# Altium schematic sheet 3_MCU.SchDoc
size A3
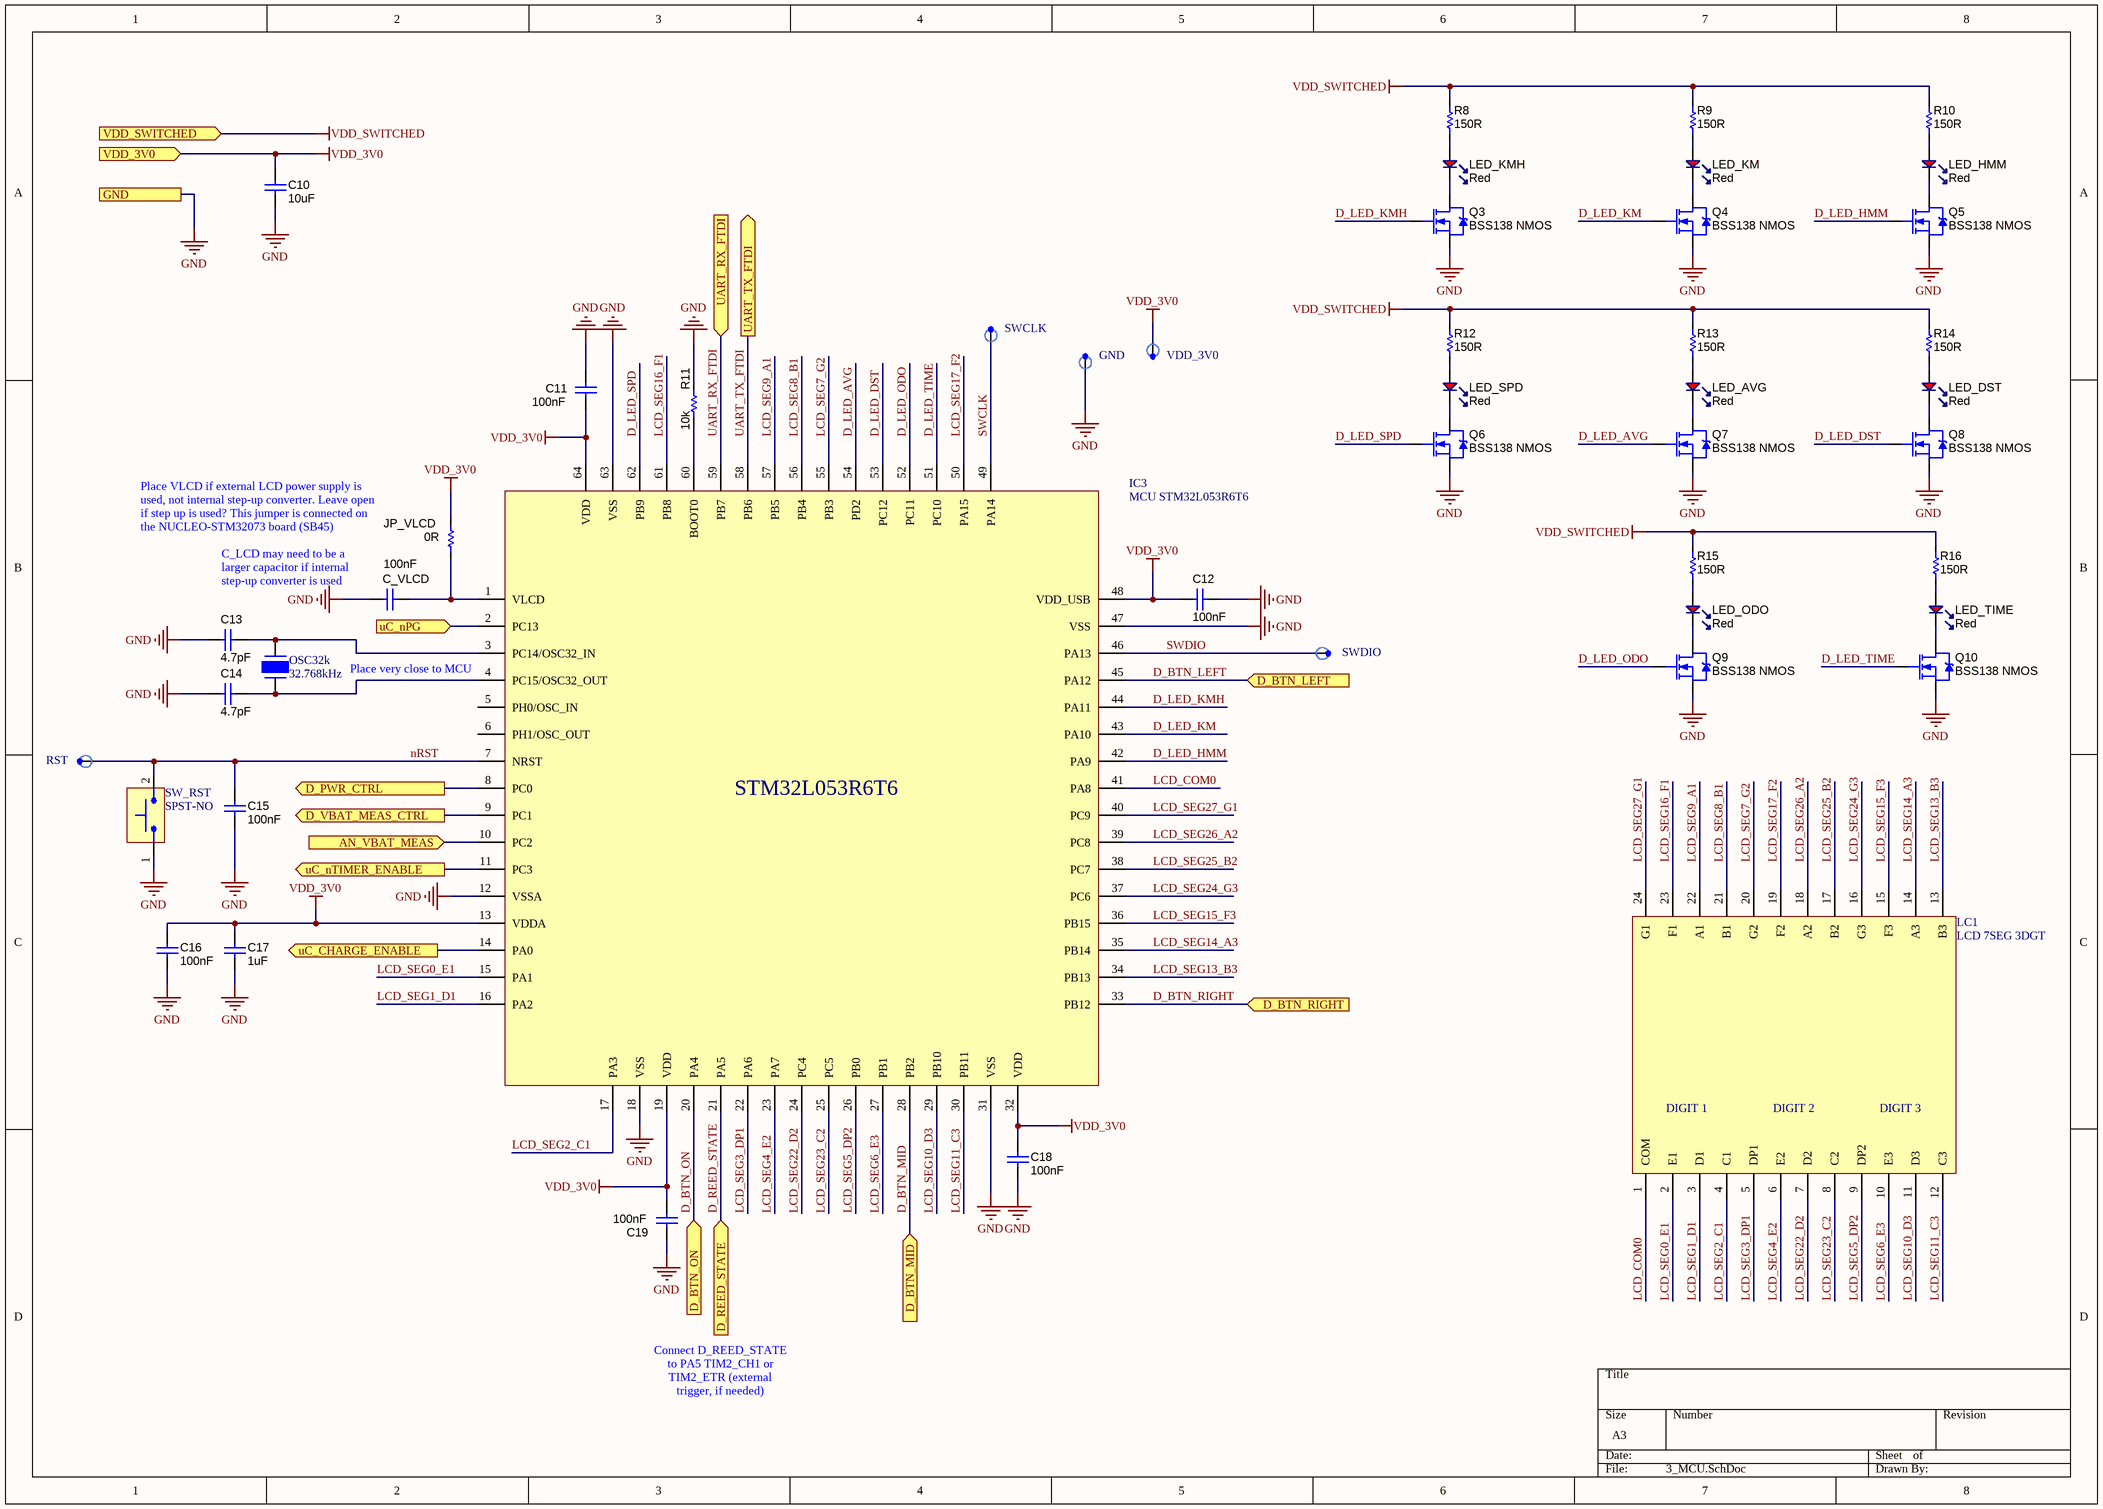
[diagram p0: 3_MCU.SchDoc]

## Parts
C10  10uF  [CAP_0603]
C11  100nF  [CAP_0603]
C12  100nF  [CAP_0603]
C13  4.7pF  [CAP_0603]
C14  4.7pF  [CAP_0603]
C15  100nF  [CAP_0603]
C16  100nF  [CAP_0603]
C17  1uF  [CAP_0603]
C18  100nF  [CAP_0603]
C19  100nF  [CAP_0603]
C_VLCD  100nF  [CAP_0603]
GND  Testpoint_SMD  [Testpoint_SMD]  (value not drawn)
IC3  MCU STM32L053R6T6  [LQFP-64]
JP_VLCD  0R  [RES_0603]
LC1  LCD 7SEG 3DGT  [24 pin 3 digit LCD (7.9mm character height)]
LED_AVG  Red  [LED_0603]
LED_DST  Red  [LED_0603]
LED_HMM  Red  [LED_0603]
LED_KM  Red  [LED_0603]
LED_KMH  Red  [LED_0603]
LED_ODO  Red  [LED_0603]
LED_SPD  Red  [LED_0603]
LED_TIME  Red  [LED_0603]
OSC32k  32.768kHz  [2x6mm cylindrical can - 0.7mm through hole]
Q3  BSS138 NMOS  [SOT-23-3]
Q4  BSS138 NMOS  [SOT-23-3]
Q5  BSS138 NMOS  [SOT-23-3]
Q6  BSS138 NMOS  [SOT-23-3]
Q7  BSS138 NMOS  [SOT-23-3]
Q8  BSS138 NMOS  [SOT-23-3]
Q9  BSS138 NMOS  [SOT-23-3]
Q10  BSS138 NMOS  [SOT-23-3]
R8  150R  [RES_0603]
R9  150R  [RES_0603]
R10  150R  [RES_0603]
R11  10k  [RES_0603]
R12  150R  [RES_0603]
R13  150R  [RES_0603]
R14  150R  [RES_0603]
R15  150R  [RES_0603]
R16  150R  [RES_0603]
RST  Testpoint_SMD  [Testpoint_SMD]  (value not drawn)
SW_RST  SPST-NO  [SWITCH_TACTILE_SMD_6X3.5mm_2pin]
SWCLK  Testpoint_SMD  [Testpoint_SMD]  (value not drawn)
SWDIO  Testpoint_SMD  [Testpoint_SMD]  (value not drawn)
VDD_3V0  Testpoint_SMD  [Testpoint_SMD]  (value not drawn)

## Ports
AN_VBAT_MEAS (in), D_BTN_LEFT (in), D_BTN_MID (in), D_BTN_ON (in), D_BTN_RIGHT (in), D_PWR_CTRL (out), D_REED_STATE (in), D_VBAT_MEAS_CTRL (out), GND, UART_RX_FTDI (in), UART_TX_FTDI (out), uC_CHARGE_ENABLE (out), uC_nPG (in), uC_nTIMER_ENABLE (out), VDD_3V0 (in), VDD_SWITCHED (in)

## Nets
GND: C10.2 C11.2 C12.2 C13.2 C14.2 C15.2 C16.2 C17.2 C18.2 C19.1 C_VLCD.2 GND.1 IC3.12(VSSA) IC3.18(VSS) IC3.31(VSS) IC3.47(VSS) IC3.63(VSS) Q3.2(S) Q4.2(S) Q5.2(S) Q6.2(S) Q7.2(S) Q8.2(S) Q9.2(S) Q10.2(S) R11.2 SW_RST.1 ; port GND
VDD_3V0: C10.1 C11.1 C12.1 C16.1 C17.1 C18.1 C19.2 IC3.13(VDDA) IC3.19(VDD) IC3.32(VDD) IC3.48(VDD_USB) IC3.64(VDD) JP_VLCD.2 VDD_3V0.1 ; port VDD_3V0
VDD_SWITCHED: R8.2 R9.2 R10.2 R12.2 R13.2 R14.2 R15.2 R16.2 ; port VDD_SWITCHED
AN_VBAT_MEAS: IC3.10(PC2) ; port AN_VBAT_MEAS
D_BTN_LEFT: IC3.45(PA12) ; port D_BTN_LEFT
D_BTN_MID: IC3.28(PB2) ; port D_BTN_MID
D_BTN_ON: IC3.20(PA4) ; port D_BTN_ON
D_BTN_RIGHT: IC3.33(PB12) ; port D_BTN_RIGHT
D_LED_AVG: IC3.54(PD2) Q7.1(G)
D_LED_DST: IC3.53(PC12) Q8.1(G)
D_LED_HMM: IC3.42(PA9) Q5.1(G)
D_LED_KM: IC3.43(PA10) Q4.1(G)
D_LED_KMH: IC3.44(PA11) Q3.1(G)
D_LED_ODO: IC3.52(PC11) Q9.1(G)
D_LED_SPD: IC3.62(PB9) Q6.1(G)
D_LED_TIME: IC3.51(PC10) Q10.1(G)
D_PWR_CTRL: IC3.8(PC0) ; port D_PWR_CTRL
D_REED_STATE: IC3.21(PA5) ; port D_REED_STATE
D_VBAT_MEAS_CTRL: IC3.9(PC1) ; port D_VBAT_MEAS_CTRL
LCD_COM0: IC3.41(PA8) LC1.1(COM)
LCD_SEG0_E1: IC3.15(PA1) LC1.2(E1)
LCD_SEG1_D1: IC3.16(PA2) LC1.3(D1)
LCD_SEG2_C1: IC3.17(PA3) LC1.4(C1)
LCD_SEG3_DP1: IC3.22(PA6) LC1.5(DP1)
LCD_SEG4_E2: IC3.23(PA7) LC1.6(E2)
LCD_SEG5_DP2: IC3.26(PB0) LC1.9(DP2)
LCD_SEG6_E3: IC3.27(PB1) LC1.10(E3)
LCD_SEG7_G2: IC3.55(PB3) LC1.20(G2)
LCD_SEG8_B1: IC3.56(PB4) LC1.21(B1)
LCD_SEG9_A1: IC3.57(PB5) LC1.22(A1)
LCD_SEG10_D3: IC3.29(PB10) LC1.11(D3)
LCD_SEG11_C3: IC3.30(PB11) LC1.12(C3)
LCD_SEG13_B3: IC3.34(PB13) LC1.13(B3)
LCD_SEG14_A3: IC3.35(PB14) LC1.14(A3)
LCD_SEG15_F3: IC3.36(PB15) LC1.15(F3)
LCD_SEG16_F1: IC3.61(PB8) LC1.23(F1)
LCD_SEG17_F2: IC3.50(PA15) LC1.19(F2)
LCD_SEG22_D2: IC3.24(PC4) LC1.7(D2)
LCD_SEG23_C2: IC3.25(PC5) LC1.8(C2)
LCD_SEG24_G3: IC3.37(PC6) LC1.16(G3)
LCD_SEG25_B2: IC3.38(PC7) LC1.17(B2)
LCD_SEG26_A2: IC3.39(PC8) LC1.18(A2)
LCD_SEG27_G1: IC3.40(PC9) LC1.24(G1)
nRST: C15.1 IC3.7(NRST) RST.1 SW_RST.2
SWCLK: IC3.49(PA14) SWCLK.1
SWDIO: IC3.46(PA13) SWDIO.1
UART_RX_FTDI: IC3.59(PB7) ; port UART_RX_FTDI
UART_TX_FTDI: IC3.58(PB6) ; port UART_TX_FTDI
uC_CHARGE_ENABLE: IC3.14(PA0) ; port uC_CHARGE_ENABLE
uC_nPG: IC3.2(PC13) ; port uC_nPG
uC_nTIMER_ENABLE: IC3.11(PC3) ; port uC_nTIMER_ENABLE
NetC13_1: C13.1 IC3.3(PC14/OSC32_IN) OSC32k.1
NetC14_1: C14.1 IC3.4(PC15/OSC32_OUT) OSC32k.2
NetC_VLCD_1: C_VLCD.1 IC3.1(VLCD) JP_VLCD.1
NetIC3_60: IC3.60(BOOT0) R11.1
NetLED_AVG_A: LED_AVG.A R13.1
NetLED_AVG_K: LED_AVG.K Q7.3(D)
NetLED_DST_A: LED_DST.A R14.1
NetLED_DST_K: LED_DST.K Q8.3(D)
NetLED_HMM_A: LED_HMM.A R10.1
NetLED_HMM_K: LED_HMM.K Q5.3(D)
NetLED_KM_A: LED_KM.A R9.1
NetLED_KM_K: LED_KM.K Q4.3(D)
NetLED_KMH_A: LED_KMH.A R8.1
NetLED_KMH_K: LED_KMH.K Q3.3(D)
NetLED_ODO_A: LED_ODO.A R15.1
NetLED_ODO_K: LED_ODO.K Q9.3(D)
NetLED_SPD_A: LED_SPD.A R12.1
NetLED_SPD_K: LED_SPD.K Q6.3(D)
NetLED_TIME_A: LED_TIME.A R16.1
NetLED_TIME_K: LED_TIME.K Q10.3(D)

Not connected (* = marked no-connect by the designer): IC3 5(PH0/OSC_IN) 6(PH1/OSC_OUT)

## Notes on the sheet
- Place VLCD if external LCD power supply is used, not internal step-up converter. Leave open if step up is used? This jumper is connected on the NUCLEO-STM32073 board (SB45)
- (near C_VLCD) C_LCD may need to be a larger capacitor if internal step-up converter is used
- (near IC3) Place very close to MCU
- Connect D_REED_STATE to PA5 TIM2_CH1 or TIM2_ETR (external trigger, if needed)
- (in symbol LCD_7SEG_3DIGIT_0.31in) DIGIT 1; DIGIT 2; DIGIT 3

## Library data of the parts
C10 = CAP_10uF_16V_0603: Cermacic Capacitor 0603 16V 10uF; Manufacturer: n/a; Manufacturer Part Number: n/a; Supplier: Kelco; Supplier Part Number: 20214; Package: 0603; Capacitance: 10uF; Voltage Rating: 16V; Tolerance: n/a; Dielectric class: n/a
C11 C12 C15 C16 C18 C19 C_VLCD = CAP_100nF_50V_0603: Cermacic Capacitor 0603 50V 100nF; Dielectric class: X7R; Manufacturer: n/a; Manufacturer Part Number: n/a; Supplier: Kelco; Supplier Part Number: 11061; Package: 0603; Capacitance: 100nF; Voltage Rating: 50V; Tolerance: n/a
C13 C14 = CAP_4.7pF_63V_NPO_0603: Ceramic Capacitor 0603 63V 4.7pF NPO; Manufacturer: n/a; Manufacturer Part Number: n/a; Supplier: Kelco; Supplier Part Number: 14345; Package: 0603; Capacitance: 4.7pF; Voltage Rating: 63V; Tolerance: n/a; Dielectric class: NPO
C17 = CAP_1uF_16V_0603: Cermacic Capacitor 0603 16V 1uF; Dielectric class: Y5V; Manufacturer: n/a; Manufacturer Part Number: n/a; Supplier: Kelco; Supplier Part Number: 12930; Package: 0603; Capacitance: 1uF; Voltage Rating: 16V; Tolerance: n/a
IC3 = IC_MCU_STM32L053R6T6_64LQFP: IC MCU STM32L053R6T6 LQFP-64; Manufacturer: STMicroelectronics; Supply Voltage: 1.65 ~ 3.6V; Manufacturer Part Number: STM32L053R6T6; Supplier: DigiKey; Supplier Part Number: 497-17898-ND; Package: 64-LQFP; Value: MCU STM32L053R6T6; Operating Temperature: -40°C ~ 85°C
JP_VLCD = RES_0R_1%_0.1W_0603: Resistor SMD 0603 0R 0.1W 1%; Manufacturer: n/a; Manufacturer Part Number: n/a; Supplier: Kelco; Supplier Part Number: 13738; Resistance: 0R; Package: 0603; Power Rating: 0.1W; Tolerance: 1%
LC1 = LCD_7SEG_3DIGIT_0.31in: 7 segment LCD display, 3 digits, 0.31in (7.9mm) character height. 3-5V; Manufacturer: Lumex Opto/Components Inc.; Manufacturer Part Number: LCD-S301C31TR; Supply Voltage: 3~5VAC; Quiescent Current: 1uA; Supplier: DigiKey; Supplier Part Number: 67-1788-ND; Value: LCD 7SEG 3DGT; Operating Temperature: 0°C ~ 80°C
LED_AVG LED_DST LED_HMM LED_KM LED_KMH LED_ODO LED_SPD LED_TIME = LED_Red_2V_20mA_0603: LED Diode SMD Green; Forward Voltage: 2V; Forward Current: 20mA; Intensity: 120mCd; Angle of Visibility: 120deg; Manufacturer: n/a; Manufacturer Part Number: n/a; Supplier: Kelco; Supplier Part Number: 18012; Color: Red; Package: 0603
OSC32k = OSCILLATOR_CRYSTAL_32.768kHz_DT26: SMD Tactile switch 2 pin 6x3.5mm SPST-NO 5mm height; Manufacturer: YIC; Manufacturer Part Number: 32.768K26/DT26; Load capacitance: 12.5pF; Supplier: Kelco; Supplier Part Number: 13808; Frequency: 32.768kHz; Operating temperature: 0°C ~ 80°C; Package: DT-26 2x6mm Cylindrical can; ComponentLink1Description: Datasheet
Q3-Q10 = MOSFET_N_60V_220mA_BSS138_SOT-23: MOSFET N-channel SMD BSS138 220mA 50V; Manufacturer: ONsemi; VGSmax: 20V; VDSmax: 60V; IDmax (pulse): 880mA; RDSon: 1Ohm; Transconductance gfs: 0.5S; PDmax: 0.35W; Vth: 1.3V; Manufacturer Part Number: BSS138; Supplier: Kelco; Supplier Part Number: 19727; Value: BSS138 NMOS; Package: SOT-23-3; IDmax: 220mA; ComponentLink1Description: Datasheet; ComponentLink1URL: https://www.onsemi.com/pdf/datasheet/nds7002a-d.pdf
R8-R10 R12-R16 = RES_150R_1%_0.1W_0603: Resistor SMD 0603 100k 0.1W 1%; Manufacturer: n/a; Manufacturer Part Number: n/a; Supplier: Kelco; Supplier Part Number: 14153; Resistance: 150R; Package: 0603; Power Rating: 0.1W; Tolerance: 1%
R11 = RES_10k_1%_0.1W_0603: Resistor SMD 0603 10k 0.1W 1%; Manufacturer: n/a; Manufacturer Part Number: n/a; Supplier: Kelco; Supplier Part Number: 11702; Resistance: 10k; Package: 0603; Power Rating: 0.1W; Tolerance: 1%
SW_RST = SWITCH_SMD_6X3.5mm_2pin: SMD Tactile switch 2 pin 6x3.5mm SPST-NO 5mm height; Manufacturer: Diptronics; Manufacturer Part Number: DTSM-32N; Rated Voltage: 12V; Rated Current: 50mA; Contact Resistance: 100mOhm; Supplier: Kelco; Supplier Part Number: 15159; Contact form: SPST-NO; ComponentLink1Description: Datasheet; ComponentLink1URL: https://eu.mouser.com/datasheet/2/910/444_DTS-3-1571561.pdf